# EAGLE design mr_radar_ferret (EAGLE 6.2)
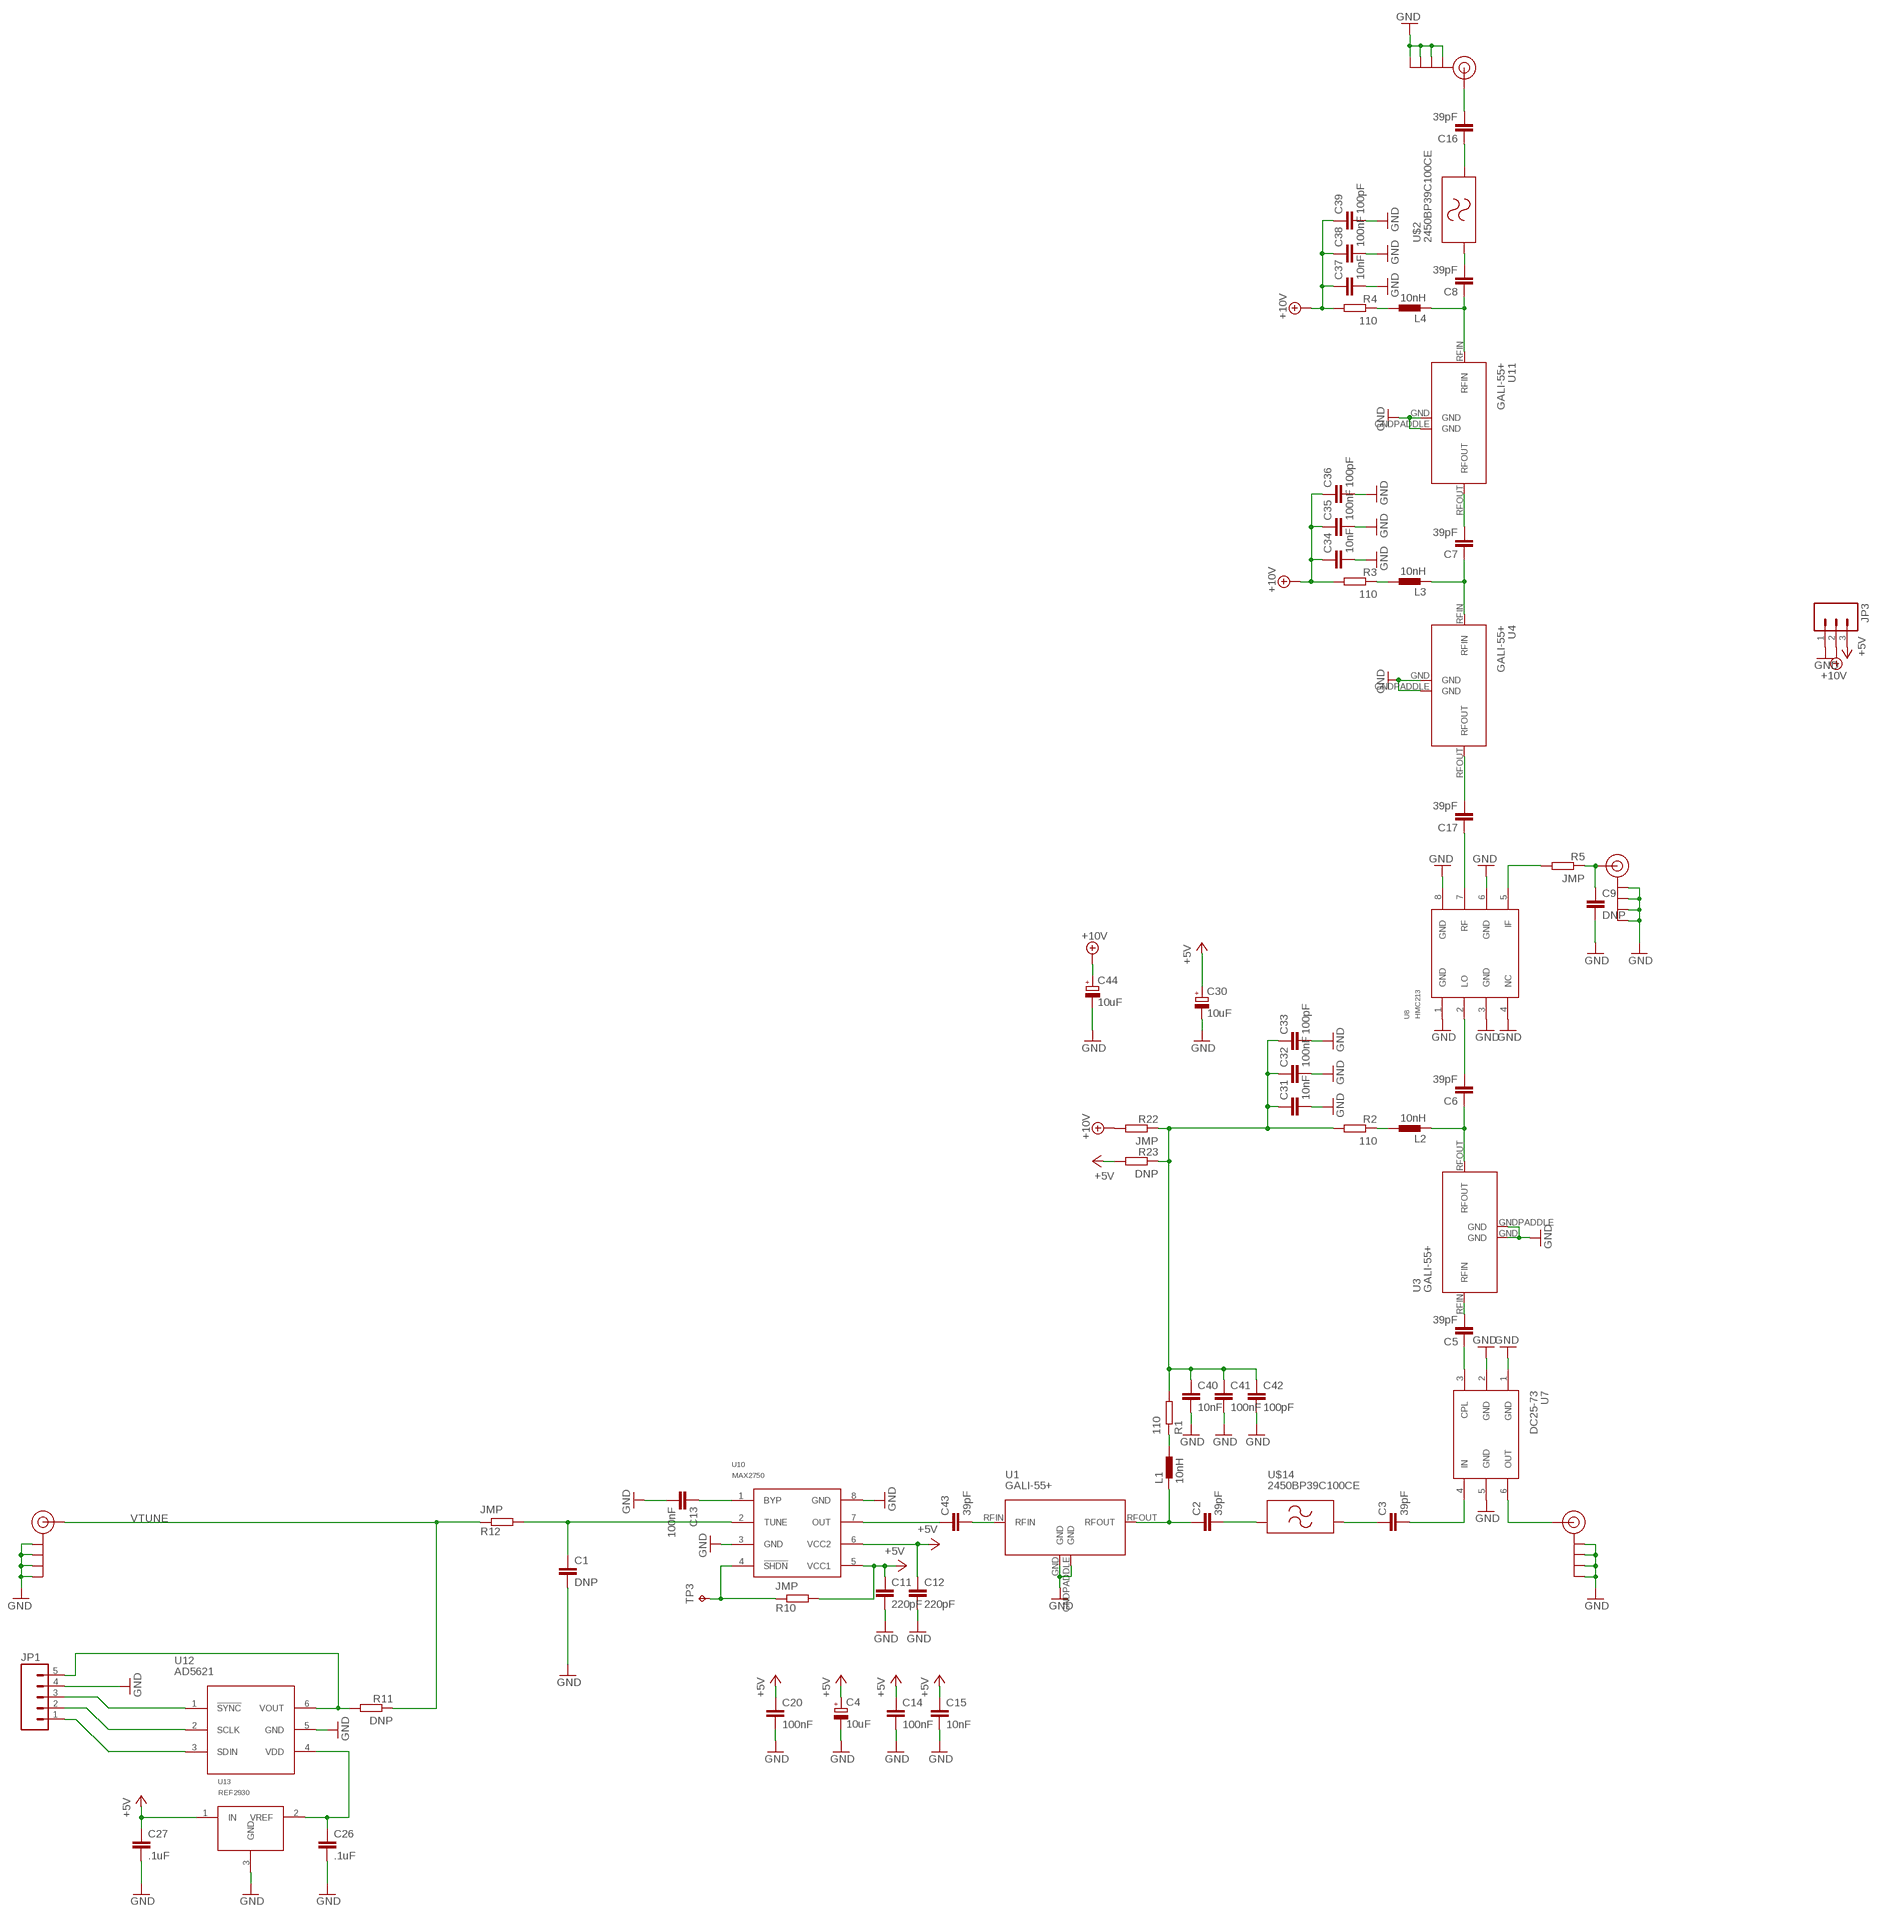
[diagram p0: schematic, sheet 1]

## Parts
C1  DNP  CAPACITOR-0603  [0603-CAP]
C2  39pF  CAPACITOR-0603  [0603-CAP]
C3  39pF  CAPACITOR-0603  [0603-CAP]
C4  10uF  CAPACITOR-POLA  [3216/A]
C5  39pF  CAPACITOR-0603  [0603-CAP]
C6  39pF  CAPACITOR-0603  [0603-CAP]
C7  39pF  CAPACITOR-0603  [0603-CAP]
C8  39pF  CAPACITOR-0603  [0603-CAP]
C9  DNP  CAPACITOR-0603  [0603-CAP]
C11  220pF  CAPACITOR-0603  [0603-CAP]
C12  220pF  CAPACITOR-0603  [0603-CAP]
C13  100nF  CAPACITOR-0603  [0603-CAP]
C14  100nF  CAPACITOR-0603  [0603-CAP]
C15  10nF  CAPACITOR-0603  [0603-CAP]
C16  39pF  CAPACITOR-0603  [0603-CAP]
C17  39pF  CAPACITOR-0603  [0603-CAP]
C20  100nF  CAPACITOR-0603  [0603-CAP]
C26  .1uF  CAPACITOR-0603  [0603-CAP]
C27  .1uF  CAPACITOR-0603  [0603-CAP]
C30  10uF  CAPACITOR-POLA  [3216/A]
C31  10nF  CAPACITOR-0603  [0603-CAP]
C32  100nF  CAPACITOR-0603  [0603-CAP]
C33  100pF  CAPACITOR-0603  [0603-CAP]
C34  10nF  CAPACITOR-0603  [0603-CAP]
C35  100nF  CAPACITOR-0603  [0603-CAP]
C36  100pF  CAPACITOR-0603  [0603-CAP]
C37  10nF  CAPACITOR-0603  [0603-CAP]
C38  100nF  CAPACITOR-0603  [0603-CAP]
C39  100pF  CAPACITOR-0603  [0603-CAP]
C40  10nF  CAPACITOR-0603  [0603-CAP]
C41  100nF  CAPACITOR-0603  [0603-CAP]
C42  100pF  CAPACITOR-0603  [0603-CAP]
C43  39pF  CAPACITOR-0603  [0603-CAP]
C44  10uF  CAPACITOR-POLA  [3216/A]
J$1  SMA_EDGE  [SMA-EDGE]
J$2  SMA_EDGE  [SMA-EDGE]
J$4  SMA_EDGE  [SMA-EDGE]
J$5  SMA_EDGE  [SMA-EDGE]
JP1  M05PTH  [1X05]
JP3  M03SCREW  [SCREWTERMINAL-3.5MM-3]
L1  10nH  INDUCTOR-0603  [0603-IND]
L2  10nH  INDUCTOR-0603  [0603-IND]
L3  10nH  INDUCTOR-0603  [0603-IND]
L4  10nH  INDUCTOR-0603  [0603-IND]
R1  110  RESISTOR-0603  [0603-RES]
R2  110  RESISTOR-0603  [0603-RES]
R3  110  RESISTOR-0603  [0603-RES]
R4  110  RESISTOR-0603  [0603-RES]
R5  JMP  RESISTOR-0603  [0603-RES]
R10  JMP  RESISTOR-0603  [0603-RES]
R11  DNP  RESISTOR-0603  [0603-RES]
R12  JMP  RESISTOR-0603  [0603-RES]
R22  JMP  RESISTOR-0603  [0603-RES]
R23  DNP  RESISTOR-0603  [0603-RES]
TP3  TPTP14SQ  [TP14SQ]
U1  GALI-55+  [SOT89]
U3  GALI-55+  [SOT89]
U4  GALI-55+  [SOT89]
U7  DC25-73  [SOT23-6]
U8  HMC213  [UMAX8]
U10  MAX2750  [UMAX8]
U11  GALI-55+  [SOT89]
U12  AD5621  [SC70-6L]
U13  REF2930  [SOT23-3]
U$2  2450BP39C100CE  [2450BP39C100C]
U$14  2450BP39C100CE  [2450BP39C100C]

## Nets
+5V: C4.+ C11.P$1 C12.P$1 C14.P$1 C15.P$1 C20.P$1 C27.P$1 C30.+ JP3.3 R10.P$2 R23.P$2 U10.5(VCC1) U10.6(VCC2) U13.1(IN)
+10V: C34.P$1 C35.P$1 C36.P$1 C37.P$1 C38.P$1 C39.P$1 C44.+ JP3.2 R3.P$2 R4.P$2 R22.P$2
GND: C1.P$2 C4.- C9.P$2 C11.P$2 C12.P$2 C13.P$2 C14.P$2 C15.P$2 C20.P$2 C26.P$2 C27.P$2 C30.- C31.P$2 C32.P$2 C33.P$2 C34.P$2 C35.P$2 C36.P$2 C37.P$2 C38.P$2 C39.P$2 C40.P$2 C41.P$2 C42.P$2 C44.- J$1.GND@0(GND) J$1.GND@1(GND) J$1.GND@2(GND) J$1.GND@3(GND) J$2.GND@0(GND) J$2.GND@1(GND) J$2.GND@2(GND) J$2.GND@3(GND) J$4.GND@0(GND) J$4.GND@1(GND) J$4.GND@2(GND) J$4.GND@3(GND) J$5.GND@0(GND) J$5.GND@1(GND) J$5.GND@2(GND) J$5.GND@3(GND) JP1.4 JP3.1 U1.GND U1.GNDPADDLE(GND) U3.GND U3.GNDPADDLE(GND) U4.GND U4.GNDPADDLE(GND) U7.1(GND) U7.2(GND) U7.5(GND) U8.1(GND) U8.3(GND) U8.4(NC) U8.6(GND) U8.8(GND) U10.3(GND) U10.8(GND) U11.GND U11.GNDPADDLE(GND) U12.5(GND) U13.3(GND)
N$2: L1.P$1 R1.P$1
N$3: C2.P$1 L1.P$2 U1.RFOUT
N$4: C2.P$2 U$14.P$2
N$5: C43.P$2 U1.RFIN
N$6: C3.P$2 U7.4(IN)
N$7: J$2.SIG(SIGNAL) U7.6(OUT)
N$8: R10.P$1 TP3.TP U10.4(!SHDN)
N$9: C17.P$2 U4.RFOUT
N$10: C5.P$1 U7.3(CPL)
N$11: C5.P$2 U3.RFIN
N$12: L2.P$1 R2.P$1
N$13: C6.P$1 L2.P$2 U3.RFOUT
N$14: C6.P$2 U8.2(LO)
N$15: C17.P$1 U8.7(RF)
N$16: L4.P$1 R4.P$1
N$17: L3.P$1 R3.P$1
N$18: C7.P$1 L3.P$2 U4.RFIN
N$20: C8.P$1 L4.P$2 U11.RFIN
N$21: C8.P$2 U$2.P$2
N$22: R5.P$2 U8.5(IF)
N$23: C7.P$2 U11.RFOUT
N$24: C13.P$1 U10.1(BYP)
N$26: C1.P$1 R12.P$2 U10.2(TUNE)
N$27: C16.P$2 J$1.SIG(SIGNAL)
N$28: C16.P$1 U$2.P$1
N$30: C3.P$1 U$14.P$1
N$39: C9.P$1 J$5.SIG(SIGNAL) R5.P$1
N$41: C26.P$1 U12.4(VDD) U13.2(VREF)
N$45: JP1.1 U12.3(SDIN)
N$46: JP1.2 U12.2(SCLK)
N$47: JP1.3 U12.1(!SYNC)
N$48: C31.P$1 C32.P$1 C33.P$1 C40.P$1 C41.P$1 C42.P$1 R1.P$2 R2.P$2 R22.P$1 R23.P$1
N$50: C43.P$1 U10.7(OUT)
N$54: JP1.5 R11.P$2 U12.6(VOUT)
VTUNE: J$4.SIG(SIGNAL) R11.P$1 R12.P$1

## Power pins joined to a net without a drawn wire
GND: U$2.PGND$3(GND) U$2.PGND$4(GND) U$14.PGND$3(GND) U$14.PGND$4(GND)

## Library data of the parts
C1-C3 C5-C9 C11-C17 C20 C26 C27 C31-C43 = pel_dipol_comp:CAPACITOR
C4 C30 C44 = pel_dipol_comp:CAPACITOR-POL
J$1 J$2 J$4 J$5 = SparkFun-Connectors:SMA_EDGE: SMA Antenna Connector End launch SMA connector. The paste layer has been removed so that the connector can be hand soldered onto the board after reflow.
JP1 = SparkFun-Connectors:M05: Header 5 Standard 5-pin 0.1" header. Use with straight break away headers (SKU : PRT-00116), right angle break away headers (PRT-00553), swiss pins (PRT-00743), machine pins (PRT-00117), and female headers (PRT-00115). Molex polarized connector foot print use with SKU : PRT-08230 with associated crimp pins and housings.
JP3 = SparkFun-Connectors:M03: Header 3 Standard 3-pin 0.1" header. Use with straight break away headers (SKU : PRT-00116), right angle break away headers (PRT-00553), swiss pins (PRT-00743), machine pins (PRT-00117), and female headers (PRT-00115). Molex polarized connector foot print use with SKU : PRT-08232 with associated crimp pins and housings.
L1-L4 = pel_dipol_comp:INDUCTOR
R1-R5 R10-R12 R22 R23 = pel_dipol_comp:RESISTOR
TP3 = testpad:TP: Test pad
U1 U3 U4 U11 = retro:GALI-55+
U7 = retro:DC25-73
U8 = retro:HMC213
U10 = retro:MAX2750
U12 = retro:AD5621
U13 = retro:REF2930: CMOS VOLTAGE REFERENCE The REF29xx is a precision, low-power, low-voltage dropout voltage reference family available in a tiny SOT23-3.
U$2 U$14 = retro:2450BP39C100CE

## Board
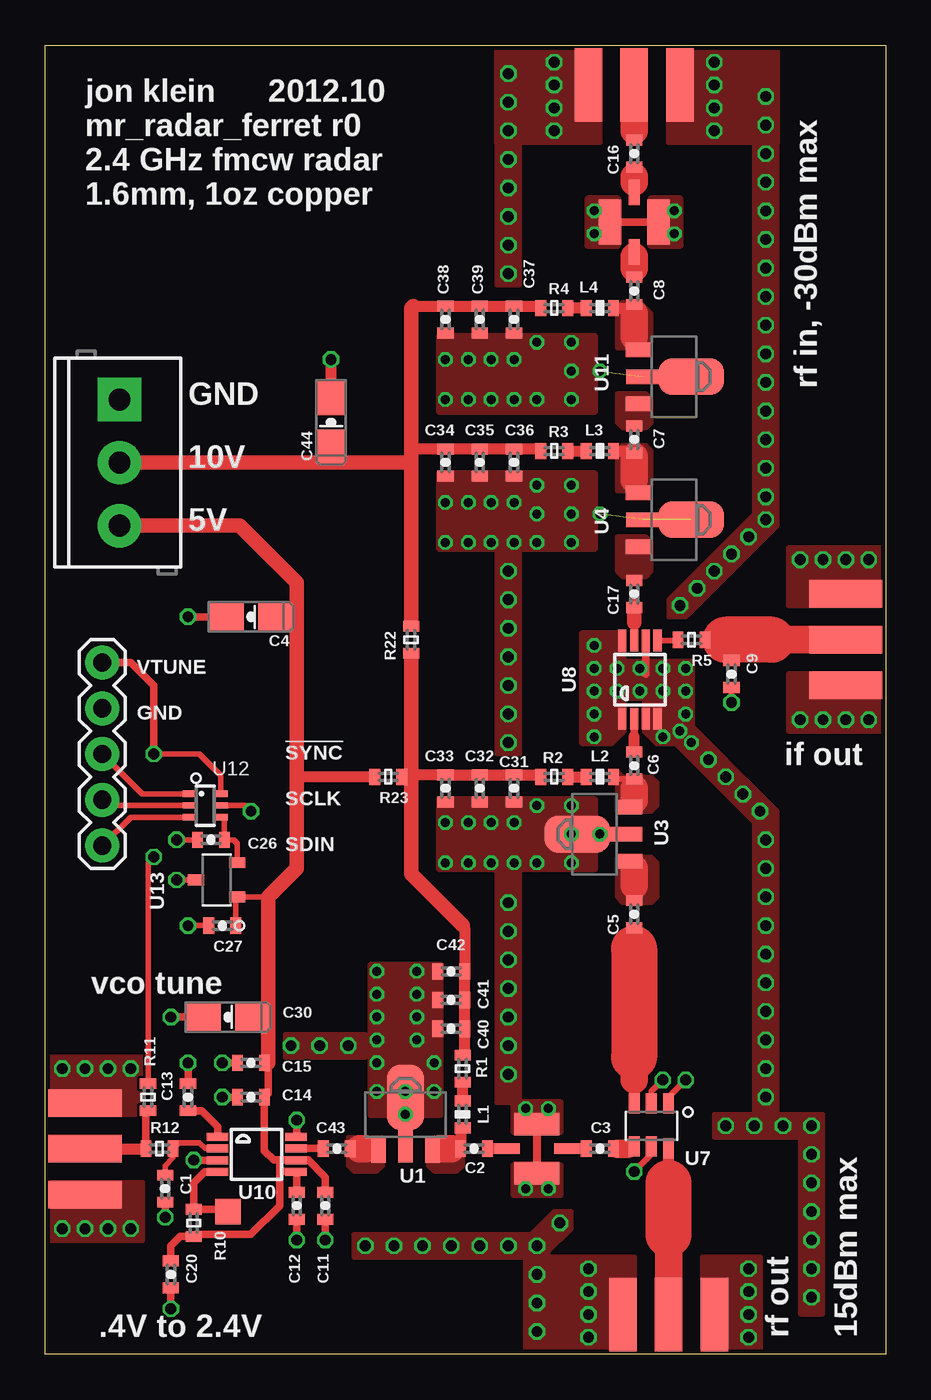
[diagram p1: board, top side]
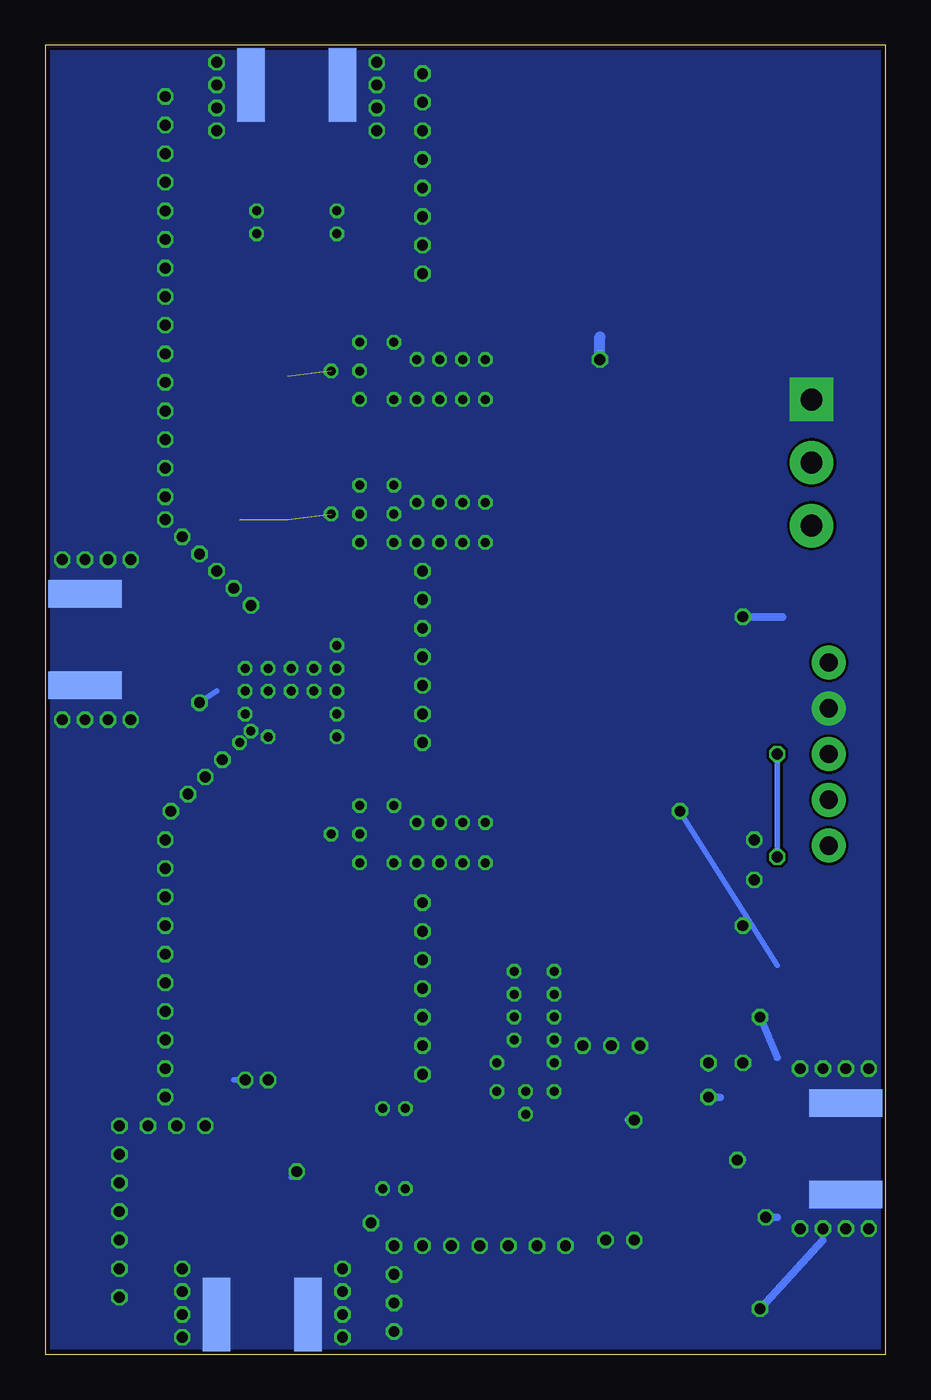
[diagram p2: board, bottom side, seen from below]

Size 46.67 x 72.71 mm. Coordinates in mm from the lower left corner, seen from the top.
Outline: 0,0 0,72.71 46.67,72.71 46.67,0 0,0
Copper layers (1*16): Top 0.035mm / dielectric 1.5mm / Bottom 0.035mm
Design rules: minimum track width 6mil, minimum drill 12mil, track to track 6mil, track to pad 6mil, pad to pad 6mil, via to via 6mil, smd to smd 0mil, copper to edge 10mil, drill to drill 10mil, minimum pad ring 10mil, minimum via ring 6mil, stop-mask expansion 2mil, vias tented up to drill 100mil, thermal gap 10mil

### Footprints (pad centres in the part's own frame; a part is rotated, then mirrored left to right if it is on the bottom)
0603-CAP = smd 0.6 x 0.9: P$1 -0.75,0; P$2 0.75,0
3216/A = smd 1.95 x 1.5: + -1.375,0; - 1.375,0
SMA-EDGE = smd 1.524 x 4.064: GND@0 0,0; GND@1 5.08,0; SIG 2.54,0 | smd 1.524 x 4.064 bottom: GND@2 0,0; GND@3 5.08,0
1X05 = drill 1.016 pad 1.88: 1 0,0; 2 2.54,0; 3 5.08,0; 4 7.62,0; 5 10.16,0
SCREWTERMINAL-3.5MM-3 = drill 1.2 pad 2.413 square: 1 0,0 | drill 1.2 pad 2.413: 2 3.5,0; 3 7,0
0603-IND = smd 0.6 x 0.9: P$1 -0.75,0; P$2 0.75,0
0603-RES = smd 0.6 x 0.9: P$1 -0.75,0; P$2 0.75,0
TP14SQ = smd 1.4 x 1.4: TP 0,0
SOT89 = smd 0.8 x 1.9: GND 0,-1.727 | smd 2.032 x 3.65: GNDPADDLE 0,0.94 | smd 0.8 x 1.4: RFIN -1.499,-1.981; RFOUT 1.499,-1.981
SOT23-6 = smd 0.6 x 1.1: 1 -0.95,-1.25; 2 0,-1.25; 3 0.95,-1.25; 4 0.95,1.15; 5 0,1.15; 6 -0.95,1.25
UMAX8 = smd 0.45 x 1.2: 1 -0.975,-2.175; 2 -0.325,-2.175; 3 0.325,-2.175; 4 0.975,-2.175; 5 0.975,2.175; 6 0.325,2.175; 7 -0.325,2.175; 8 -0.975,2.175
SC70-6L = smd 0.35 x 0.8: 1 -0.65,-0.85; 2 0,-0.85; 3 0.65,-0.85; 4 0.65,0.85; 5 0,0.85; 6 -0.65,0.85
SOT23-3 = smd 0.6 x 0.9: 1 -0.95,-1.15; 2 0.95,-1.15; 3 0,1.15
2450BP39C100C = smd 1.4 x 0.6: P$1 1.65,0; P$2 -1.65,0 | smd 2.5 x 1.25: PGND$3 0,1.35; PGND$4 0,-1.35

### Placement (x,y rotation side)
C1  6.67,9.21 270 top
C2  23.81,11.43 0 top
C3  30.8,11.43 0 top
C4  11.43,40.96 180 top
C5  32.7,24.45 90 top
C6  32.7,32.7 90 top
C7  32.7,50.8 90 top
C8  32.7,59.05 90 top
C9  38.1,37.78 270 top
C11  15.56,8.26 270 top
C12  13.97,8.26 270 top
C13  7.94,14.29 90 top
C14  11.43,14.29 180 top
C15  11.43,16.19 180 top
C16  32.7,66.67 90 top
C17  32.7,42.23 90 top
C20  6.99,4.45 270 top
C26  9.21,28.58 180 top
C27  9.84,23.81 180 top
C30  10.16,18.73 180 top
C31  26.04,31.43 270 top
C32  24.13,31.43 270 top
C33  22.23,31.43 270 top
C34  22.23,49.53 270 top
C35  24.13,49.53 270 top
C36  26.04,49.53 270 top
C37  26.04,57.47 270 top
C38  22.23,57.47 270 top
C39  24.13,57.47 270 top
C40  22.54,18.1 180 top
C41  22.54,19.68 180 top
C42  22.54,21.27 180 top
C43  16.19,11.43 0 top
C44  15.88,51.75 90 top
J$1  30.16,70.48 0 top
J$2  32.07,2.22 0 top
J$4  2.22,8.89 90 top
J$5  44.45,37.15 90 top
JP1  3.17,28.26 90 top
JP3  4.13,53.02 270 top
L1  23.18,13.34 270 top
L2  30.8,32.07 0 top
L3  30.8,50.16 0 top
L4  30.8,58.1 0 top
R1  23.18,15.88 90 top
R2  28.26,32.07 180 top
R3  28.26,50.16 180 top
R4  28.26,58.1 180 top
R5  35.88,39.69 180 top
R10  8.26,7.3 270 top
R11  5.71,14.29 90 top
R12  6.35,11.43 0 top
R22  20.32,39.69 90 top
R23  19.05,32.07 180 top
TP3  10.16,7.94 90 top
U1  20,13.34 0 top
U3  30.48,28.89 90 top
U4  34.92,46.35 270 top
U7  33.66,12.7 180 top
U8  33.02,37.47 0 top
U10  11.75,11.11 270 top
U11  34.92,54.29 270 top
U12  8.89,30.48 270 top
U13  9.53,26.35 90 top
U$2  32.7,62.87 90 top
U$14  27.3,11.43 0 top

### Tracks (layer width: path | path; a pad name or v marks a point on that pad's centre or on a via)
+5V
  Top 0.305: C27.P$1 10.59,25.32 U13.1 12.38,25.4
  Top 0.406: 13.02,10.79 U10.6 14.61,10.79 15.56,9.84 C11.P$1 | 13.02,10.79 12.7,10.79 12.18,11.31 C14.P$1 12.38,14.49 12.38,16.19 C15.P$1 | 13.02,10.16 13.9,10.16 U10.5 13.97,10.09 C12.P$1 | 13.02,10.16 13.02,10.79 | 13.02,10.16 13.02,8.26 11.43,6.67 8.37,6.67 R10.P$2 7.5,6.55 6.99,6.03 C20.P$1 | C30.+ 11.85,19.05 12.38,19.05 | C4.+ 13.97,40.96
  Top 0.61: R23.P$2 13.97,32.07
  Top 0.813: 12.38,16.19 12.38,19.05 12.38,25.4 13.97,26.99 13.97,32.07 13.97,40.96 13.97,42.86 10.81,46.02 JP3.3
+10V
  Top 0.61: R4.P$2 27.39,58.22 C37.P$1 C39.P$1 C38.P$1 20.43,58.22 | R3.P$2 27.39,50.28 C36.P$1 C35.P$1 C34.P$1 20.32,50.28 | 16.82,49.52 20,49.52 arc90 20.32,49.85 | C44.+ 15.88,49.84 arc-90 15.56,49.52 | R22.P$2 20.32,40.64
  Top 0.813: JP3.2 15.56,49.52 16.82,49.52 | 16.83,49.53 20.32,49.53 | 20.32,49.53 20.32,49.85 20.32,50.28 20.32,58.1 20.43,58.22 | 20.32,40.64 20.32,49.53
GND  (via drill 0.5, 0.6)  (3 unrouted)
  Top 0.305: U12.5 11.11,30.48 v11.43,30.16 | U13.3 v7.3,26.35 | U7.5 33.66,11.11 v32.7,10.16 | U7.2 33.66,14.61 v34.29,15.24 | 34.61,14.29 U7.1 34.6,14.28 v35.56,15.24 | C26.P$2 v7.3,28.58 | C9.P$2 v38.1,36.2 | C27.P$2 v7.94,23.81
  Top 0.406: U10.8 13.97,12.09 v13.97,13.02 | U10.3 v8.26,10.79 | C30.- v6.99,18.73 | C20.P$2 v6.99,2.54 | C1.P$2 v6.67,7.62 | C13.P$2 v7.94,16.19 | C11.P$2 v15.56,6.35 | C12.P$2 v13.97,6.35 | C14.P$2 v9.84,14.29 | C15.P$2 v9.84,16.19 | C4.- v7.94,40.96 | U8.6 33.34,39.64 33.34,37.78 | U3.GNDPADDLE U3.GND | U11.GND U11.GNDPADDLE | U1.GNDPADDLE U1.GND
  Top 0.61: C44.- v15.88,55.24
  Bottom 0.305: v11.43,30.16 7.45,23.84 | 7.45,23.84 6.03,21.59 | v32.7,10.16 33.02,9.84 | v34.29,15.24 34.61,15.24 | v35.56,15.24 36.2,15.24 | v7.3,28.58 6.99,28.58 | v38.1,36.2 37.15,36.83 | v7.94,23.81 7.91,23.84 7.45,23.84
  Bottom 0.406: v13.97,13.02 14.29,13.02 | v8.26,10.79 7.94,10.79 | v6.99,18.73 6.03,16.51 | v13.97,6.35 13.97,6.03 | v9.84,14.29 9.21,14.29 | v6.99,2.54 3.49,6.35 | v6.67,7.62 6.03,7.62 | v9.84,16.19 9.84,15.87 | v7.94,40.96 5.71,40.96
  Bottom 0.61: v15.88,55.24 15.88,56.52
  other vias: 4.76,15.88 3.49,15.88 2.22,15.88 0.95,15.88 0.95,6.98 2.22,6.98 3.49,6.98 4.76,6.98 28.26,71.75 28.26,70.48 28.26,69.21 28.26,67.94 37.15,67.94 37.15,69.21 37.15,70.48 37.15,71.75 39.05,0.95 39.05,2.22 39.05,3.49 39.05,4.76 30.16,4.76 30.16,3.49 30.16,2.22 30.16,0.95 45.72,44.13 44.45,44.13 43.18,44.13 41.91,44.13 41.91,35.24 43.18,35.24 44.45,35.24 45.72,35.24 35.88,33.97 34.29,34.29 35.56,35.56 35.56,36.83 35.56,38.1 34.29,38.1 34.29,36.83 33.02,36.83 33.02,38.1 31.75,38.1 31.75,36.83 30.48,36.83 30.48,38.1 30.48,39.37 30.48,35.56 30.48,34.29 26.67,13.65 26.67,9.21 27.94,9.21 27.94,13.65 30.48,63.5 30.48,62.23 34.92,63.5 34.92,62.23 26.04,29.53 24.77,29.53 27.3,30.48 27.3,27.3 26.04,27.3 24.77,27.3 23.5,27.3 23.5,29.53 22.23,29.53 22.23,27.3 26.04,55.24 24.77,55.24 27.3,56.2 27.3,53.02 26.04,53.02 24.77,53.02 23.5,53.02 23.5,55.24 22.23,55.24 22.23,53.02 26.04,47.31 24.77,47.31 27.3,48.26 27.3,45.09 26.04,45.09 24.77,45.09 23.5,45.09 23.5,47.31 22.23,47.31 22.23,45.09 20.64,17.46 20.64,18.73 21.59,16.19 18.41,16.19 18.41,17.46 18.41,18.73 18.41,20 20.64,20 20.64,21.27 18.41,21.27 29.21,48.26 29.21,46.67 29.21,45.09 27.3,46.67 30.8,46.67 30.8,54.61 29.21,56.2 29.21,54.61 29.21,53.02 29.21,30.48 29.21,28.89 29.21,27.3 30.8,28.89 20,13.34 21.59,14.61 20,14.61 18.41,14.61 37.78,12.7 39.37,12.7 40.96,12.7 42.55,12.7 40.01,23.81 40.01,25.4 40.01,26.99 40.01,28.58 39.69,30.16 40.01,14.29 40.01,15.88 40.01,17.46 40.01,19.05 40.01,20.64 40.01,22.23 25.72,15.56 25.72,17.14 25.72,18.73 25.72,20.32 25.72,21.91 25.72,23.5 25.72,25.08 27.3,1.27 27.3,2.86 27.3,4.45 27.3,6.03 28.57,7.3 42.55,3.18 42.55,4.76 42.55,6.35 42.55,7.94 42.55,9.53 42.55,11.11 25.72,33.97 25.72,35.56 25.72,37.15 25.72,38.73 25.72,40.32 25.72,41.91 25.72,43.5 25.72,64.77 25.72,66.36 25.72,67.94 25.72,69.53 25.72,60.01 25.72,61.6 25.72,63.18 25.72,71.12 40.01,55.56 40.01,57.15 40.01,58.74 40.01,60.33 40.01,61.91 40.01,63.5 40.01,47.62 40.01,49.21 40.01,50.8 40.01,52.39 40.01,53.98 40.01,65.09 40.01,66.67 40.01,68.26 40.01,69.85 38.1,44.45 39.05,45.4 35.24,41.59 36.2,42.55 37.15,43.5 16.83,17.14 15.24,17.14 13.65,17.14 25.72,6.03 24.13,6.03 22.54,6.03 20.95,6.03 19.37,6.03 17.78,6.03 40.01,46.35 36.83,33.02 37.78,32.07 38.73,31.12 35.24,34.61
  pour Bottom (no thermals): -4.13,86.04 -4.13,-7.94 81.92,-7.94 81.92,86.04
  pour Top (no thermals): 25.08,67.31 30.8,67.31 30.8,72.39 25.08,72.39
  pour Top (no thermals): 40.64,72.39 34.61,72.39 34.61,67.31 40.64,67.31
  pour Top (no thermals): 39.69,5.4 36.51,5.4 36.51,0.32 39.69,0.32
  pour Top (no thermals): 26.67,0.32 32.7,0.32 32.7,5.4 26.67,5.4
  pour Top (no thermals): 0.32,16.51 0.32,13.34 5.4,13.34 5.4,16.51
  pour Top (no thermals): 5.4,6.35 5.4,9.53 0.32,9.53 0.32,6.35
  pour Top (no thermals): 41.27,44.77 41.27,41.59 46.35,41.59 46.35,44.77
  pour Top (no thermals): 46.35,34.61 46.35,37.78 41.27,37.78 41.27,34.61
  pour Top (no thermals): 33.34,36.51 33.34,34.61 33.97,33.97 35.88,33.97 35.88,38.42 32.07,38.42 32.07,40.01 29.84,40.01 29.84,33.97 31.43,33.97 32.07,34.61 32.07,36.51
  pour Top (no thermals): 26.04,12.38 26.04,13.97 28.57,13.97 28.57,12.38
  pour Top (no thermals): 26.04,10.48 26.04,8.89 28.57,8.89 28.57,10.48
  pour Top (no thermals): 30.16,64.13 30.16,61.6 31.75,61.6 31.75,64.13
  pour Top (no thermals): 33.66,64.13 33.66,61.6 35.24,61.6 35.24,64.13
  pour Top (no thermals): 30.48,52.39 30.48,56.52 21.91,56.52 21.91,52.39
  pour Top (no thermals): 30.48,44.77 30.48,48.9 21.91,48.9 21.91,44.77
  pour Top (no thermals): 30.48,26.99 30.48,30.8 21.91,30.8 21.91,26.99
  pour Top (no thermals): 18.1,13.34 21.91,13.34 21.91,21.59 18.1,21.59
  pour Top: 41.91,2.22 43.18,2.22 43.18,13.34 40.64,13.34 40.64,30.16 39.37,31.43 39.37,13.34 37.15,13.34 37.15,12.06 41.91,12.06
  pour Top: 27.94,0.64 27.94,5.71 29.21,6.98 29.21,7.94 28.26,7.94 26.99,6.67 17.14,6.67 17.14,5.4 26.67,5.4 26.67,0.64
  pour Top: 13.34,17.78 17.78,17.78 17.78,16.51 13.34,16.51
  pour Top: 25.08,13.97 25.08,26.99 26.35,26.99 26.35,13.97
  pour Top: 25.08,33.34 26.35,33.34 26.35,44.77 25.08,44.77
  pour Top: 34.61,40.96 35.56,40.96 40.64,46.04 40.64,70.48 39.37,70.48 39.37,46.67 34.61,41.91
  pour Top: 25.08,59.37 26.35,59.37 26.35,60.64 26.35,71.75 25.08,71.75
  pour Top: 34.29,33.97 34.92,33.97 39.37,29.53 39.37,31.43 36.2,34.61 35.88,34.92 35.24,34.92 34.92,34.61
N$2
  Top 0.61: L1.P$1 R1.P$1
N$3
  Top 0.305: 21.91,11.43 21.5,11.43 U1.RFOUT
  Top 0.61: 22.54,11.43 C2.P$1 23.06,12.59 L1.P$2
  Top 1.524: 22.54,11.43 21.91,11.43
  pour Top (no thermals): 21.27,11.75 21.27,10.48 21.59,10.16 22.86,10.16 23.18,10.48 23.18,12.06 21.59,12.06
N$4
  Top 0.61: U$14.P$2 C2.P$2
N$5
  Top 0.305: 17.46,11.43 C43.P$2
  Top 0.61: U1.RFIN 17.86,11.35 17.78,11.43
  Top 1.524: 17.78,11.43 17.46,11.43
  pour Top (no thermals): 16.83,12.06 16.83,10.48 17.14,10.16 18.41,10.16 18.73,10.48 18.73,12.06
N$6
  Top 0.61: C3.P$2 31.75,11.43 | 32.38,11.43 32.7,11.43 U7.4
  Top 1.016: 31.75,11.43 32.38,11.43
N$7
  Top 0.305: U7.6
  Top 0.61: 34.61,10.16 34.6,10.16 | U7.6 34.6,10.16 | 34.61,9.53 34.6,9.53 34.6,10.16
  Top 1.524: 34.61,6.67 J$2.SIG
  Top 2.54: 34.61,6.67 34.61,9.53
N$8
  Top 0.406: U10.4 8.87,10.14 8.26,9.53 R10.P$1 10.04,8.05 arc-90 TP3.TP
N$9
  pour Top (no thermals): 31.75,45.4 31.75,43.5 32.07,43.18 33.34,43.18 33.66,43.5 33.66,45.09 33.34,45.4
N$10
  Top 0.61: U7.3 32.7,15.24 | C5.P$1 32.7,22.54
  Top 1.524: 32.7,16.51 32.7,15.24
  Top 2.54: 32.7,22.54 32.7,16.51
N$11
  Top 0.305: 32.7,26.03 C5.P$2
  Top 0.61: U3.RFIN 32.7,27.39 32.7,26.99
  Top 1.524: 32.7,26.99 32.7,26.03
  pour Top (no thermals): 31.75,27.62 33.66,27.62 33.97,27.3 33.97,25.4 33.66,25.08 32.07,25.08 31.75,25.4
N$12
  Top 0.61: R2.P$1 L2.P$1
N$13
  Top 0.305: 32.7,30.8 32.46,30.56 U3.RFOUT | L2.P$2 31.66,31.95 C6.P$1
  Top 0.406: C6.P$1 32.7,31.43
  Top 1.524: 32.7,31.43 32.7,30.8
  pour Top (no thermals): 31.75,30.16 31.75,32.38 32.07,32.07 33.66,32.07 33.97,31.75 33.97,30.48 33.66,30.16
N$14
  Top 0.406: 32.7,34.29 32.7,34.3 U8.2
  Top 0.61: C6.P$2 32.7,34.29
N$15
  Top 0.406: 32.7,40.64 32.7,40.63 U8.7
  Top 0.61: C17.P$1 32.7,41.59
  Top 0.813: 32.7,41.59 32.7,40.64
N$16
  Top 0.61: L4.P$1 R4.P$1
N$17
  Top 0.61: R3.P$1 L3.P$1
N$18
  Top 0.305: C7.P$1 32.7,49.85 | 32.7,48.58 32.7,48.41
  Top 0.61: L3.P$2 32.59,50.16 C7.P$1
  Top 1.524: 32.7,49.85 32.7,48.58
  pour Top (no thermals): 31.75,50.16 31.75,47.94 33.34,47.94 33.66,48.26 33.66,50.16 33.34,50.48 32.07,50.48
N$20
  Top 0.305: C8.P$1 32.7,57.79 | 32.7,56.52 32.46,56.52
  Top 0.61: L4.P$2 32.7,58.1 C8.P$1
  Top 1.524: 32.7,57.79 32.7,56.52
  pour Top (no thermals): 33.02,58.42 33.66,57.79 33.66,56.2 33.34,55.88 31.75,55.88 31.75,58.1 32.07,58.42
N$21
  Top 0.254: U$2.P$2 32.7,60.96 | 32.7,60.33 C8.P$2
  Top 0.305: C8.P$2 32.7,60.01
  Top 1.524: 32.7,60.96 32.7,60.33
N$22
  Top 0.305: R5.P$2 35.08,39.64 U8.5
N$23
  pour Top (no thermals): 31.75,53.34 33.34,53.34 33.66,53.02 33.66,51.75 33.34,51.44 32.07,51.44 31.75,51.75
N$24
  Top 0.406: U10.1 9.57,12.65 8.69,13.54 C13.P$1
N$26
  Top 0.305: U10.2 8.88,11.44 8.57,11.75 7.42,11.75 R12.P$2 7.1,10.91 6.67,10.48 C1.P$1
N$27
  Top 0.305: 32.7,67.95 C16.P$2
  Top 1.524: J$1.SIG 32.7,67.95
N$28
  Top 0.254: 32.7,65.4 U$2.P$1
  Top 0.305: C16.P$1 32.7,65.4
  Top 1.524: 32.7,65.09 32.7,65.4
N$30
  Top 0.61: C3.P$1 U$14.P$1
N$39
  Top 0.305: R5.P$1 36.83,39.69 | 37.78,39.69 C9.P$1
  Top 0.813: 36.83,39.69 37.78,39.69
  Top 1.524: 40.32,39.69 J$5.SIG
  Top 2.54: 40.32,39.69 37.78,39.69
N$41
  Top 0.305: U12.4 9.76,29.84 9.84,29.84 9.96,29.73 C26.P$1 10.48,28.58 10.68,28.38 U13.2
N$45
  Top 0.305: U12.3 4.75,29.83 JP1.1
N$46
  Top 0.305: U12.2 3.49,30.48 JP1.2
N$47
  Top 0.305: U12.1 5.38,31.13 JP1.3
N$48
  Top 0.406: R22.P$1 20.32,38.73
  Top 0.61: R2.P$2 27.39,32.18 C31.P$1 C32.P$1 C33.P$1 20.43,32.18 arc90 20.32,32.07 R23.P$1 | R1.P$2 23.29,16.62 C40.P$1 C41.P$1 C42.P$1 23.29,23.7 23.18,23.81
  Top 0.813: 20.32,38.73 20.32,32.07 20.32,26.67 23.18,23.81
N$50
  Top 0.406: U10.7 C43.P$1
N$54  (via drill 0.6)
  Top 0.305: U12.6 9.76,31.12 9.76,32.16 8.57,33.34 v6.03,33.34 | v6.03,27.62 5.71,27.3 R11.P$2
  Top 0.406: JP1.5 4.76,38.42 6.03,37.15 v6.03,33.34
  Bottom 0.305: v6.03,33.34 v6.03,27.62
VTUNE
  Top 0.305: 5.71,11.54 R12.P$1
  Top 0.406: R11.P$1 5.6,13.42 R12.P$1
  Top 0.61: J$4.SIG R12.P$1

### Text on the board
_tsilk: jon klein | 2012.10 | mr_radar_ferret r0 | 2.4 GHz fmcw radar | 1.6mm, 1oz copper | rf in, -30dBm max | GND | 10V | 5V | VTUNE | GND | !SYNC | if out | SCLK | SDIN | vco tune | .4V to 2.4V | rf out | 15dBm max